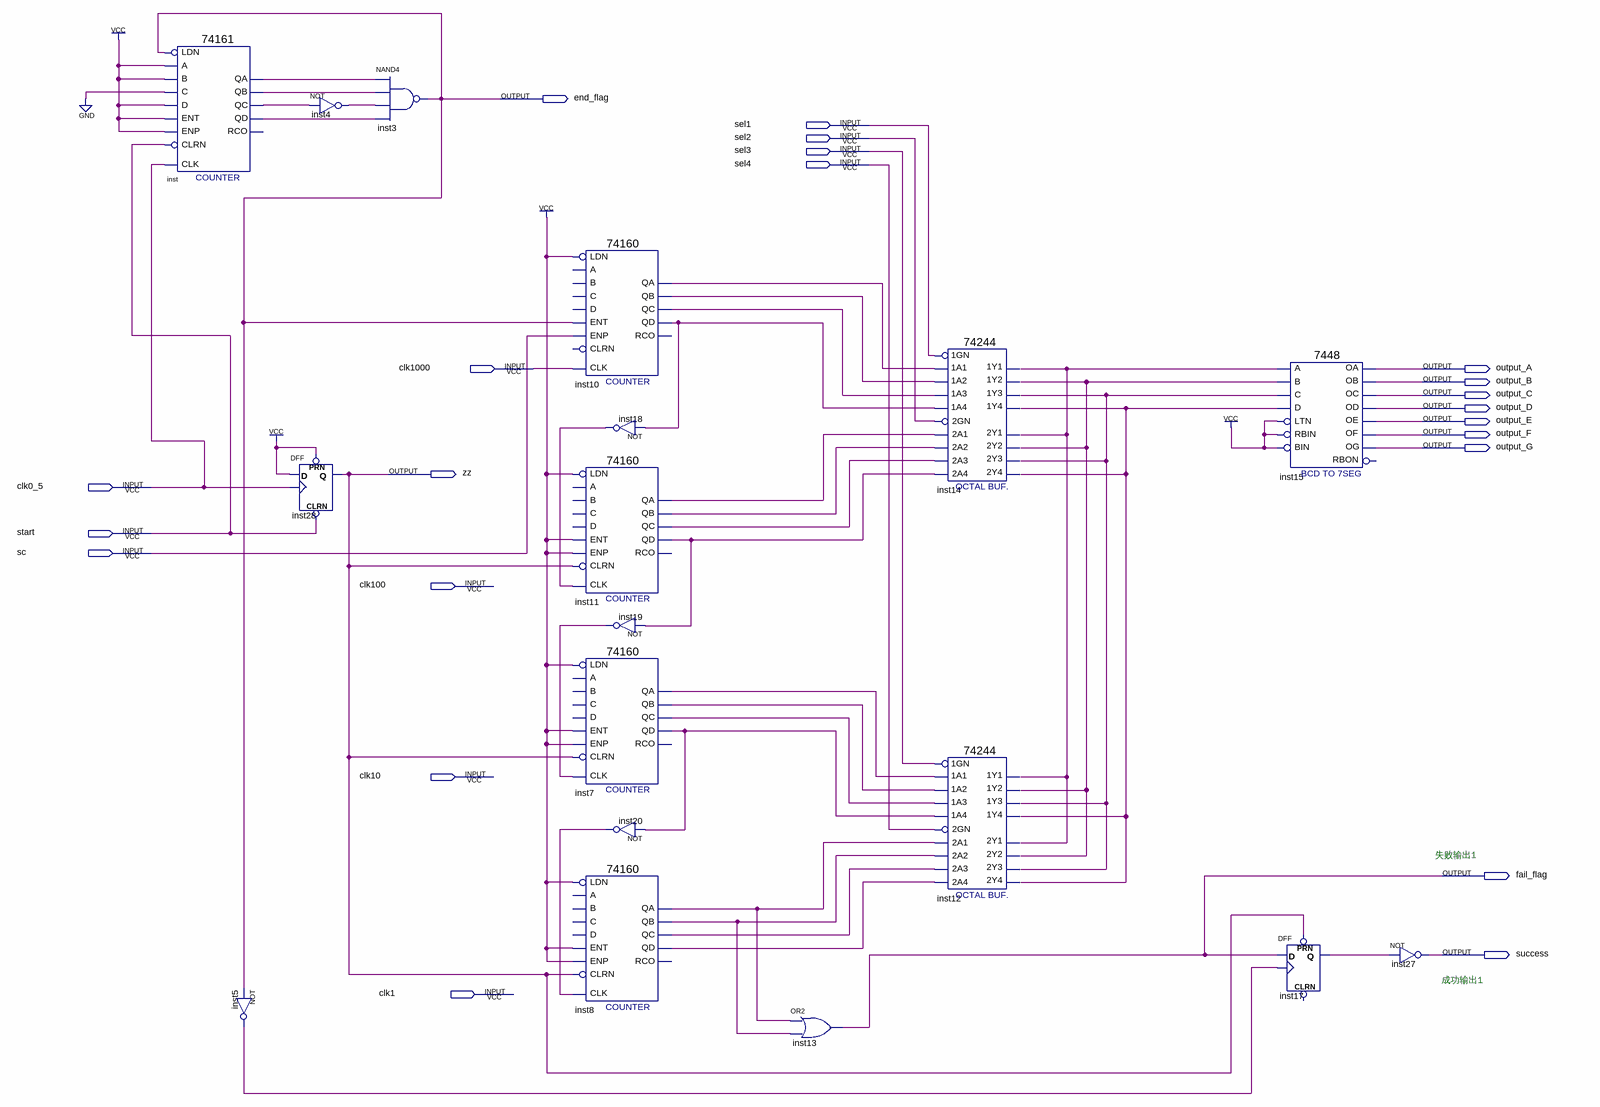
[diagram p0: schematic sheet]
// Quartus schematic dy_time.bdf as structural Verilog: 18 symbols, 22 pins
module dy_time (
  input  sel1,
  input  sel2,
  input  sel3,
  input  sel4,
  input  clk1000,
  input  clk0_5,
  input  start,
  input  sc,
  input  clk100,
  input  clk10,
  input  clk1,
  output end_flag,
  output output_A,
  output output_B,
  output output_C,
  output output_D,
  output output_E,
  output output_F,
  output output_G,
  output zz,
  output fail_flag,
  output success
);

  wire inst4_out, inst5_out, inst7_qa, inst7_qb, inst7_qc, inst7_qd, inst8_qa, inst8_qb, inst8_qc, inst8_qd,
       inst10_qa, inst10_qb, inst10_qc, inst10_qd, inst11_qa, inst11_qb, inst11_qc, inst11_qd, inst14_1y2,
       inst14_1y4, inst14_2y1, inst14_2y3, inst17_q, inst18_out, inst19_out, inst20_out, inst_qa, inst_qb,
       inst_qc, inst_qd;

  \74161  inst (
    .CLRN(start), .CLK(clk0_5), .ENP(1'b1), .LDN(end_flag), .A(1'b1), .D(1'b1), .ENT(1'b1), .B(1'b1),
    .C(1'b0), .QD(inst_qd), .QC(inst_qc), .QB(inst_qb), .QA(inst_qa));  // open: RCO
  not inst5 (inst5_out, end_flag);
  not inst4 (inst4_out, inst_qc);
  DFF inst28 (.CLRN(start), .CLK(clk0_5), .D(1'b1), .PRN(1'b1), .Q(zz));
  nand inst3 (end_flag, inst_qa, inst_qb, inst4_out, inst_qd);
  \74160  inst10 (
    .CLK(clk1000), .ENT(end_flag), .LDN(1'b1), .ENP(sc), .QD(inst10_qd), .QA(inst10_qa), .QB(inst10_qb),
    .QC(inst10_qc));  // open: A, B, C, D, CLRN, RCO
  \74160  inst11 (
    .CLK(inst18_out), .ENT(1'b1), .LDN(1'b1), .ENP(1'b1), .CLRN(zz), .QD(inst11_qd), .QA(inst11_qa),
    .QB(inst11_qb), .QC(inst11_qc));  // open: A, B, C, D, RCO
  \74160  inst7 (
    .CLK(inst19_out), .ENT(1'b1), .LDN(1'b1), .ENP(1'b1), .CLRN(zz), .QD(inst7_qd), .QA(inst7_qa),
    .QB(inst7_qb), .QC(inst7_qc));  // open: A, B, C, D, RCO
  \74160  inst8 (
    .CLK(inst20_out), .ENT(1'b1), .LDN(1'b1), .ENP(1'b1), .CLRN(zz), .QD(inst8_qd), .QA(inst8_qa),
    .QB(inst8_qb), .QC(inst8_qc));  // open: A, B, C, D, RCO
  not inst18 (inst18_out, inst10_qd);
  not inst19 (inst19_out, inst11_qd);
  not inst20 (inst20_out, inst7_qd);
  or inst13 (fail_flag, inst8_qa, inst8_qb);
  \74244  inst14 (
    .\1A2 (inst10_qb), .\1A4 (inst10_qd), .\1A1 (inst10_qa), .\1A3 (inst10_qc), .\1GN (sel1),
    .\2A3 (inst11_qc), .\2GN (sel2), .\2A1 (inst11_qa), .\2A4 (inst11_qd), .\2A2 (inst11_qb),
    .\1Y2 (inst14_1y2), .\1Y4 (inst14_1y4), .\2Y1 (inst14_2y1), .\1Y1 (inst14_2y1), .\2Y3 (inst14_2y3),
    .\2Y4 (inst14_1y4), .\1Y3 (inst14_2y3), .\2Y2 (inst14_1y2));
  \74244  inst12 (
    .\1A2 (inst7_qb), .\1A4 (inst7_qd), .\1A1 (inst7_qa), .\1A3 (inst7_qc), .\1GN (sel3), .\2A3 (inst8_qc),
    .\2GN (sel4), .\2A1 (inst8_qa), .\2A4 (inst8_qd), .\2A2 (inst8_qb), .\1Y2 (inst14_1y2),
    .\1Y4 (inst14_1y4), .\2Y1 (inst14_2y1), .\1Y1 (inst14_2y1), .\2Y3 (inst14_2y3), .\2Y4 (inst14_1y4),
    .\1Y3 (inst14_2y3), .\2Y2 (inst14_1y2));
  \7448  inst15 (
    .A(inst14_2y1), .C(inst14_2y3), .D(inst14_1y4), .B(inst14_1y2), .RBIN(1'b1), .BIN(1'b1), .LTN(1'b1),
    .OC(output_C), .OE(output_E), .OD(output_D), .OF(output_F), .OG(output_G), .OB(output_B), .OA(output_A));  // open: RBON
  DFF inst17 (.CLK(inst5_out), .D(fail_flag), .PRN(zz), .Q(inst17_q));  // open: CLRN
  not inst27 (success, inst17_q);

  // Notes on the sheet:
  //   失败输出1
  //   成功输出1
endmodule
